# Altium schematic sheet Top_Level.SchDoc
size B; SheetNumber: 5; SheetTotal: 5
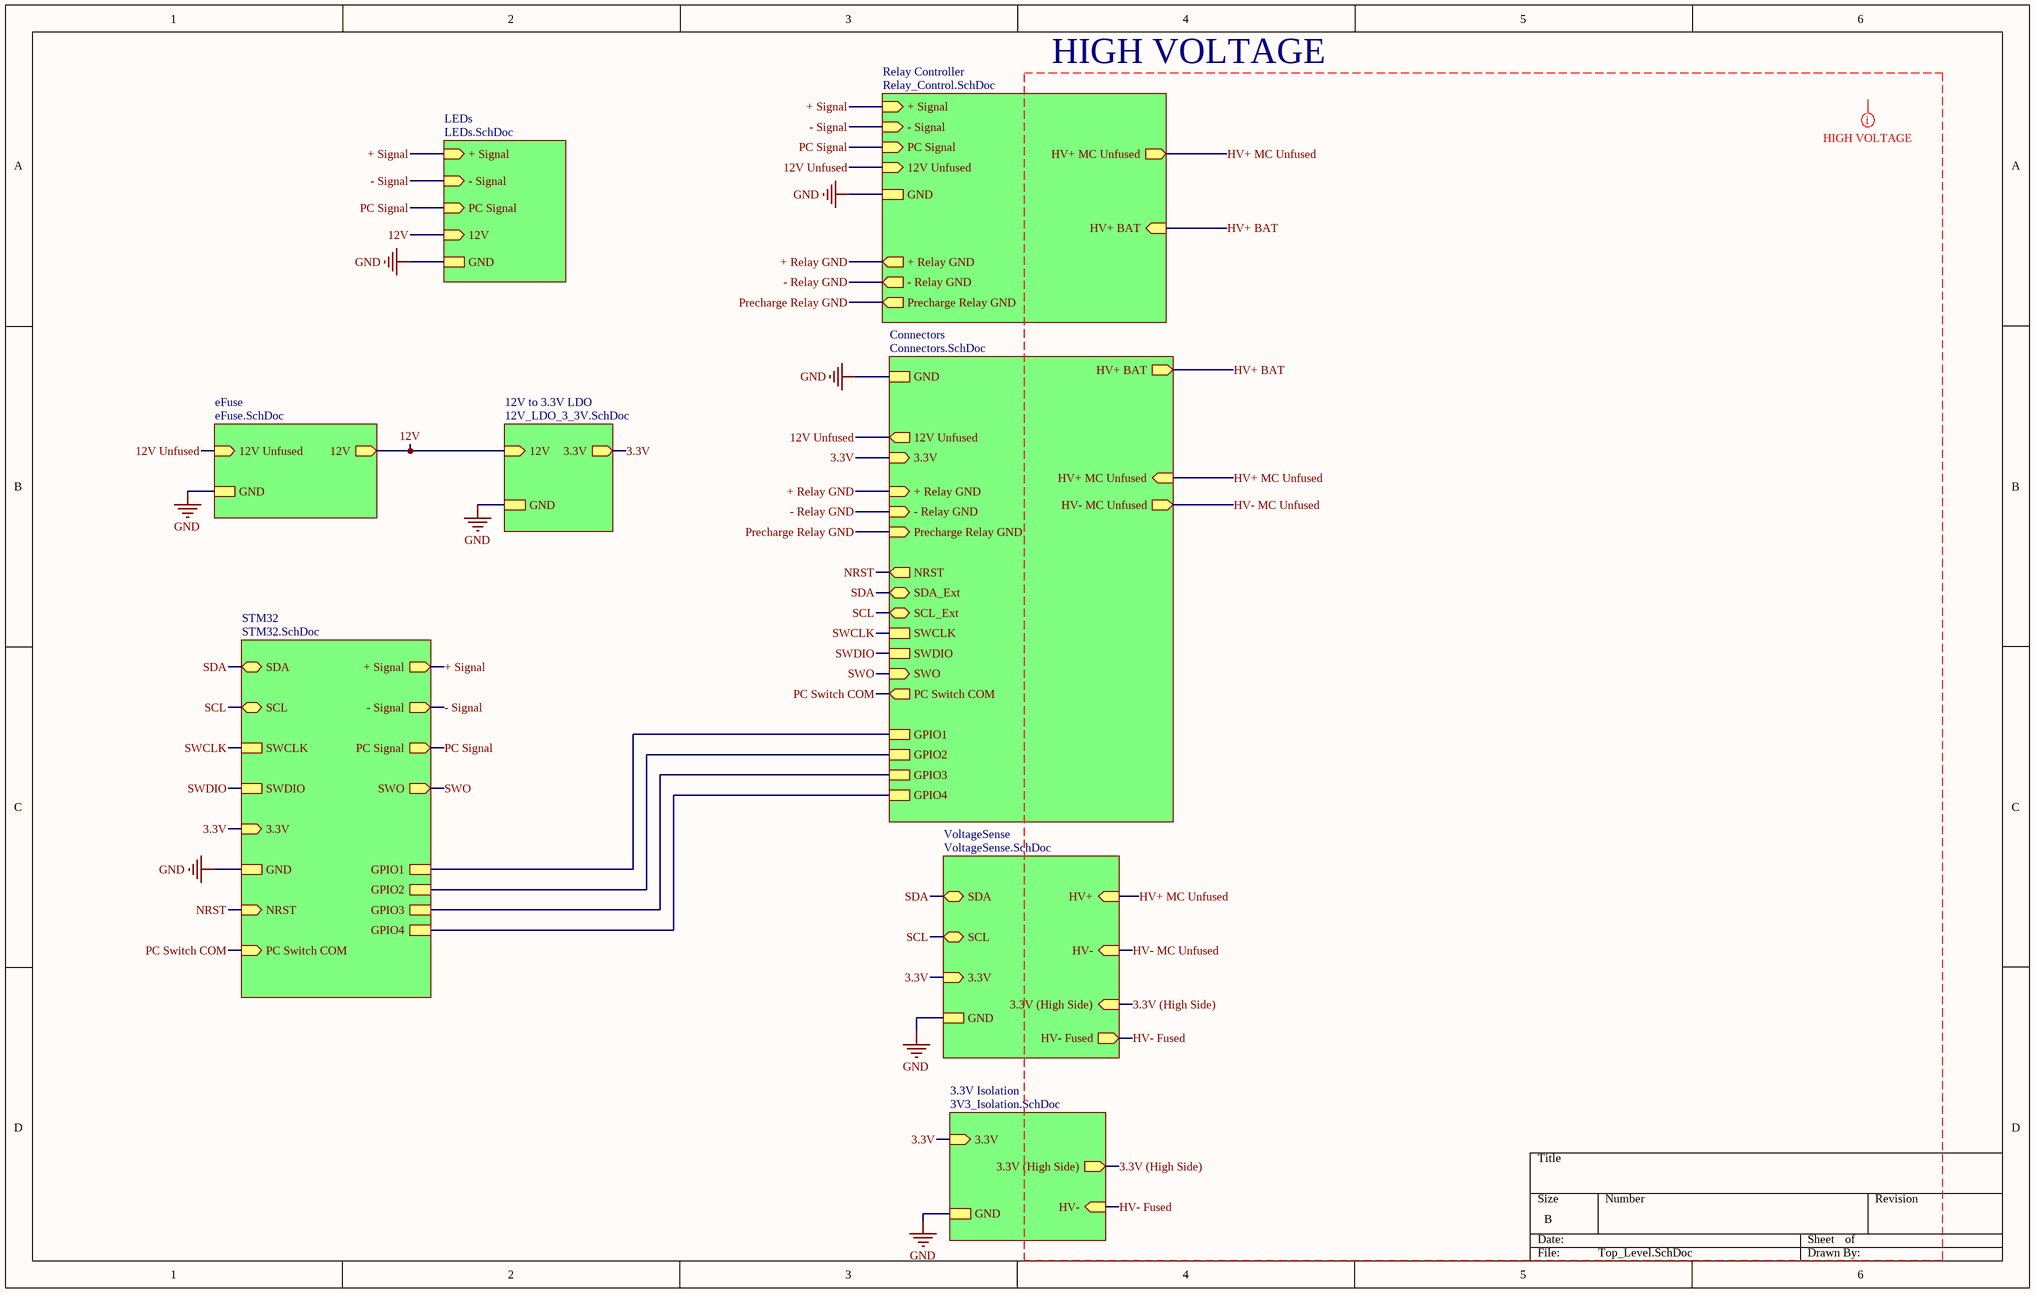
[diagram p0: Top_Level.SchDoc]

## Sub-sheets
3.3V Isolation = 3V3_Isolation.SchDoc: GND, 3.3V (in), 3.3V (High Side) (out), HV- (in)
12V to 3.3V LDO = 12V_LDO_3_3V.SchDoc: 12V (in), GND, 3.3V (out)
Connectors = Connectors.SchDoc: GND, + Relay GND (in), - Relay GND (in), Precharge Relay GND (in), HV+ BAT (out), 12V Unfused (out), HV+ MC Unfused (in), HV- MC Unfused (out), 3.3V (in), SDA_Ext (bidir), SCL_Ext (bidir), SWCLK, SWDIO, SWO (in), NRST (out), GPIO1, GPIO2, GPIO3, GPIO4, PC Switch COM (out)
eFuse = eFuse.SchDoc: 12V Unfused (in), GND, 12V (out)
LEDs = LEDs.SchDoc: + Signal (in), - Signal (in), PC Signal (in), 12V (in), GND
Relay Controller = Relay_Control.SchDoc: + Signal (in), - Signal (in), PC Signal (in), 12V Unfused (in), GND, + Relay GND (out), - Relay GND (out), Precharge Relay GND (out), HV+ MC Unfused (out), HV+ BAT (in)
STM32 = STM32.SchDoc: SDA (bidir), SCL (bidir), 3.3V (in), + Signal (out), - Signal (out), PC Signal (out), GND, SWCLK, SWDIO, SWO (out), NRST (in), GPIO1, GPIO2, GPIO3, GPIO4, PC Switch COM (in)
VoltageSense = VoltageSense.SchDoc: HV+ (in), HV- (in), 3.3V (in), SDA (bidir), SCL (bidir), GND, 3.3V (High Side) (in), HV- Fused (out)

## Nets
GND: sheet Relay Controller/GND, sheet Connectors/GND, sheet LEDs/GND, sheet STM32/GND, sheet VoltageSense/GND, sheet eFuse/GND, sheet 12V to 3.3V LDO/GND, sheet 3.3V Isolation/GND
3.3V: sheet Connectors/3.3V, sheet STM32/3.3V, sheet VoltageSense/3.3V, sheet 12V to 3.3V LDO/3.3V, sheet 3.3V Isolation/3.3V
3.3V (High Side): sheet VoltageSense/3.3V (High Side), sheet 3.3V Isolation/3.3V (High Side)
12V: sheet LEDs/12V, sheet eFuse/12V, sheet 12V to 3.3V LDO/12V
12V Unfused: sheet Relay Controller/12V Unfused, sheet Connectors/12V Unfused, sheet eFuse/12V Unfused
+ Relay GND: sheet Relay Controller/+ Relay GND, sheet Connectors/+ Relay GND
+ Signal: sheet Relay Controller/+ Signal, sheet LEDs/+ Signal, sheet STM32/+ Signal
- Relay GND: sheet Relay Controller/- Relay GND, sheet Connectors/- Relay GND
- Signal: sheet Relay Controller/- Signal, sheet LEDs/- Signal, sheet STM32/- Signal
HV+ BAT: sheet Relay Controller/HV+ BAT, sheet Connectors/HV+ BAT
HV+ MC Unfused: sheet Relay Controller/HV+ MC Unfused, sheet Connectors/HV+ MC Unfused, sheet VoltageSense/HV+
HV- Fused: sheet VoltageSense/HV- Fused, sheet 3.3V Isolation/HV-
HV- MC Unfused: sheet Connectors/HV- MC Unfused, sheet VoltageSense/HV-
NRST: sheet Connectors/NRST, sheet STM32/NRST
PC Signal: sheet Relay Controller/PC Signal, sheet LEDs/PC Signal, sheet STM32/PC Signal
PC Switch COM: sheet Connectors/PC Switch COM, sheet STM32/PC Switch COM
Precharge Relay GND: sheet Relay Controller/Precharge Relay GND, sheet Connectors/Precharge Relay GND
SCL: sheet Connectors/SCL_Ext, sheet STM32/SCL, sheet VoltageSense/SCL
SDA: sheet Connectors/SDA_Ext, sheet STM32/SDA, sheet VoltageSense/SDA
SWCLK: sheet Connectors/SWCLK, sheet STM32/SWCLK
SWDIO: sheet Connectors/SWDIO, sheet STM32/SWDIO
SWO: sheet Connectors/SWO, sheet STM32/SWO
(unnamed): sheet Connectors/GPIO1, sheet STM32/GPIO1
(unnamed): sheet Connectors/GPIO2, sheet STM32/GPIO2
(unnamed): sheet Connectors/GPIO3, sheet STM32/GPIO3
(unnamed): sheet Connectors/GPIO4, sheet STM32/GPIO4

## Layout directives
mark named HIGH VOLTAGE: 3.3V (High Side), HV+ BAT, HV+ MC Unfused, HV- Fused, HV- MC Unfused

## Notes on the sheet
- HIGH VOLTAGE